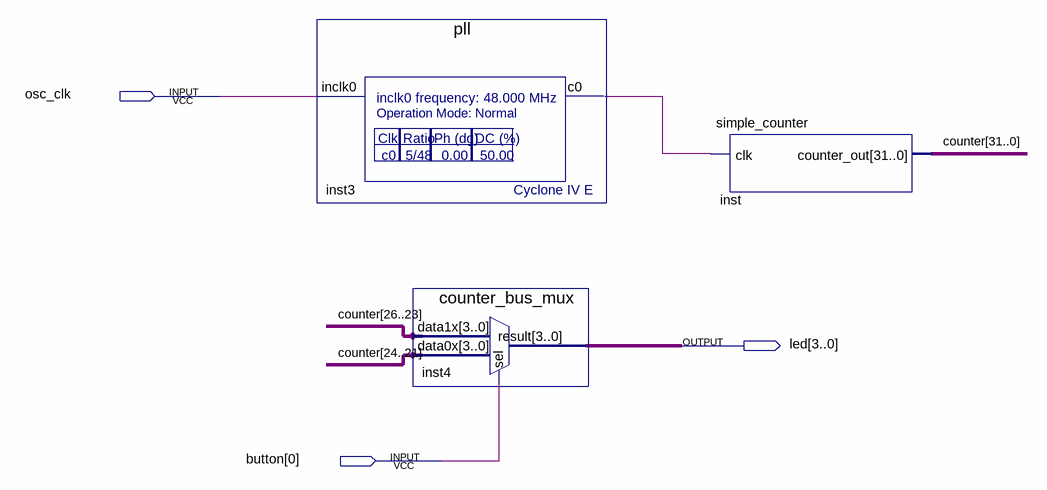
[diagram p0: schematic sheet]
// Quartus schematic ClkDetect.bdf as structural Verilog: 3 symbols, 3 pins
module ClkDetect (
  input  osc_clk,
  input  [0:0] button,
  output [3:0] led
);

  wire inst3_c0;
  wire [31:0] counter;

  pll inst3 (.inclk0(osc_clk), .c0(inst3_c0));
  counter_bus_mux inst4 (.data1x(counter[26:23]), .data0x(counter[24:21]), .sel(button[0]), .result(led));
  simple_counter inst (.clk(inst3_c0), .counter_out(counter));
endmodule
